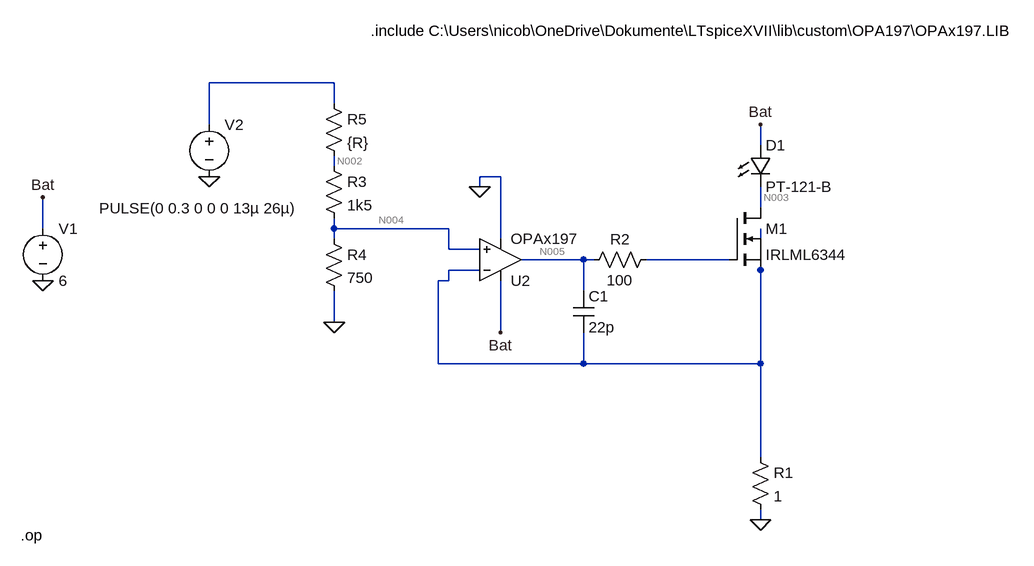
[diagram p0: schematic Draft2.asc]
Draft2.asc, the LTspice schematic file:
Version 4
SHEET 1 1440 680
WIRE 272 -128 80 -128
WIRE 272 -96 272 -128
WIRE 80 -64 80 -128
WIRE 928 -32 928 -64
WIRE 272 0 272 -16
WIRE 528 16 496 16
WIRE 496 32 496 16
WIRE 928 64 928 32
WIRE -176 96 -176 48
WIRE 272 96 272 80
WIRE 448 96 272 96
WIRE 272 112 272 96
WIRE 528 112 528 16
WIRE 448 128 448 96
WIRE 496 128 448 128
WIRE 656 144 560 144
WIRE 672 144 656 144
WIRE 880 144 752 144
WIRE 496 160 448 160
WIRE 928 160 928 96
WIRE 448 176 448 160
WIRE 448 176 432 176
WIRE 656 192 656 144
WIRE 272 240 272 192
WIRE 528 256 528 176
WIRE 432 304 432 176
WIRE 656 304 656 256
WIRE 656 304 432 304
WIRE 928 304 928 160
WIRE 928 304 656 304
WIRE 928 448 928 304
WIRE 928 544 928 528
FLAG -176 48 Bat
FLAG -176 176 0
FLAG 528 256 Bat
FLAG 496 32 0
FLAG 928 544 0
FLAG 80 16 0
FLAG 928 -64 Bat
FLAG 272 240 0
SYMBOL voltage -176 80 R0
WINDOW 123 0 0 Left 0
WINDOW 39 0 0 Left 0
SYMATTR InstName V1
SYMATTR Value 6
SYMBOL res 912 432 R0
SYMATTR InstName R1
SYMATTR Value 1
SYMBOL nmos 880 64 R0
SYMATTR InstName M1
SYMATTR Value IRLML6344
SYMBOL voltage 80 -80 R0
WINDOW 3 -169 145 Left 2
WINDOW 123 0 0 Left 0
WINDOW 39 0 0 Left 0
SYMATTR InstName V2
SYMATTR Value PULSE(0 0.3 0 0 0 13µ 26µ)
SYMBOL LED 912 -32 R0
SYMATTR InstName D1
SYMATTR Value PT-121-B
SYMBOL res 768 128 R90
WINDOW 0 0 56 VBottom 2
WINDOW 3 32 56 VTop 2
SYMATTR InstName R2
SYMATTR Value 100
SYMBOL cap 640 192 R0
SYMATTR InstName C1
SYMATTR Value 22p
SYMBOL OpAmps\\opamp2 528 208 M180
SYMATTR InstName U2
SYMATTR Value OPAx197
SYMBOL res 256 -16 R0
SYMATTR InstName R3
SYMATTR Value 1k5
SYMBOL res 256 96 R0
SYMATTR InstName R4
SYMATTR Value 750
SYMBOL res 256 -112 R0
SYMATTR InstName R5
SYMATTR Value {R}
TEXT 328 -208 Left 2 !.include C:\\Users\\nicob\\OneDrive\\Dokumente\\LTspiceXVII\\lib\\custom\\OPA197\\OPAx197.LIB
TEXT -210 568 Left 2 !.op

The netlist it stands for:
* Draft2.asc
V1 Bat 0 6
R1 N007 0 1
M1 N003 N006 N007 N007 IRLML6344
V2 N001 0 PULSE(0 0.3 0 0 0 13µ 26µ)
D1 Bat N003 PT-121-B
R2 N006 N005 100
C1 N005 N007 22p
XU2 N004 N007 Bat 0 N005 OPAx197  ; pins In+ In- V+ V- OUT
R3 N002 N004 1k5
R4 N004 0 750
R5 N001 N002 {R}
.model D D
.lib standard.dio
.model NMOS NMOS
.model PMOS PMOS
.lib standard.mos
.include C:\Users\nicob\OneDrive\Dokumente\LTspiceXVII\lib\custom\OPA197\OPAx197.LIB
.op
.backanno
.end

* Results of the author's LTspice run, read from the files saved beside the schematic
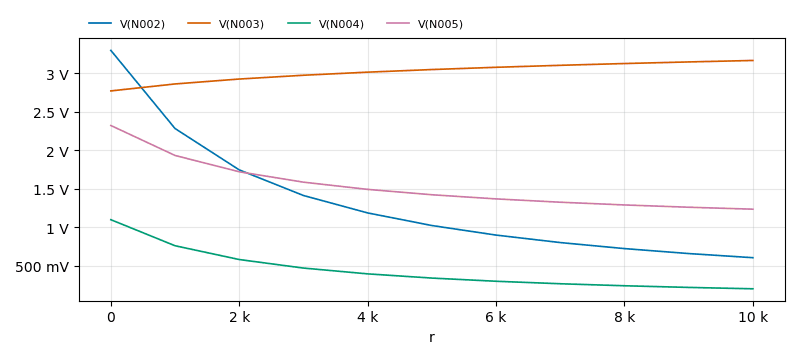
[diagram p1: Operating Point of Draft2.asc, plotted from the saved traces]
* Operating Point, 1 run:
*   V(N002): 3.3 V at r=1 µ, 606.1 mV at r=10 k, min 606.1 mV, max 3.3 V
*   V(N003): 2.773 V at r=1 µ, 3.169 V at r=10 k, min 2.773 V, max 3.169 V
*   V(N004): 1.1 V at r=1 µ, 202 mV at r=10 k, min 202 mV, max 1.1 V
*   V(N005): 2.324 V at r=1 µ, 1.236 V at r=10 k, min 1.236 V, max 2.324 V
* From the log:
*   Semiconductor Device Operating Points:
*                           --- Diodes ---
*   Name:  d:u2:_u1:2  d:u2:_u1:1      d1
*   Model: u2:_u1:dvn  u2:_u1:dvn   pt-121-b
*   Id:      1.00e-02    1.00e-02    1.10e+00
*   Vd:      8.34e-01    8.34e-01    3.23e+00
*   Req:     2.59e+00    2.59e+00    1.97e-01
*   CAP:     0.00e+00    0.00e+00    2.61e-08
*                           --- VDMOSFET Transistors ---
*   Name:          m1
*   Model:      irlml6344
*   Id:          1.10e+00
*   Vgs:         1.22e+00
*   Vds:         1.67e+00
*   Vth:         9.50e-01
*   Gm:          7.37e+00
*   Gds:         0.00e+00
*   Cgs:         1.50e-10
*   Cgd:         4.62e-10
*   Cbody:       6.12e-11